# EAGLE schematic jd9_redraw (EAGLE 9.6.0)
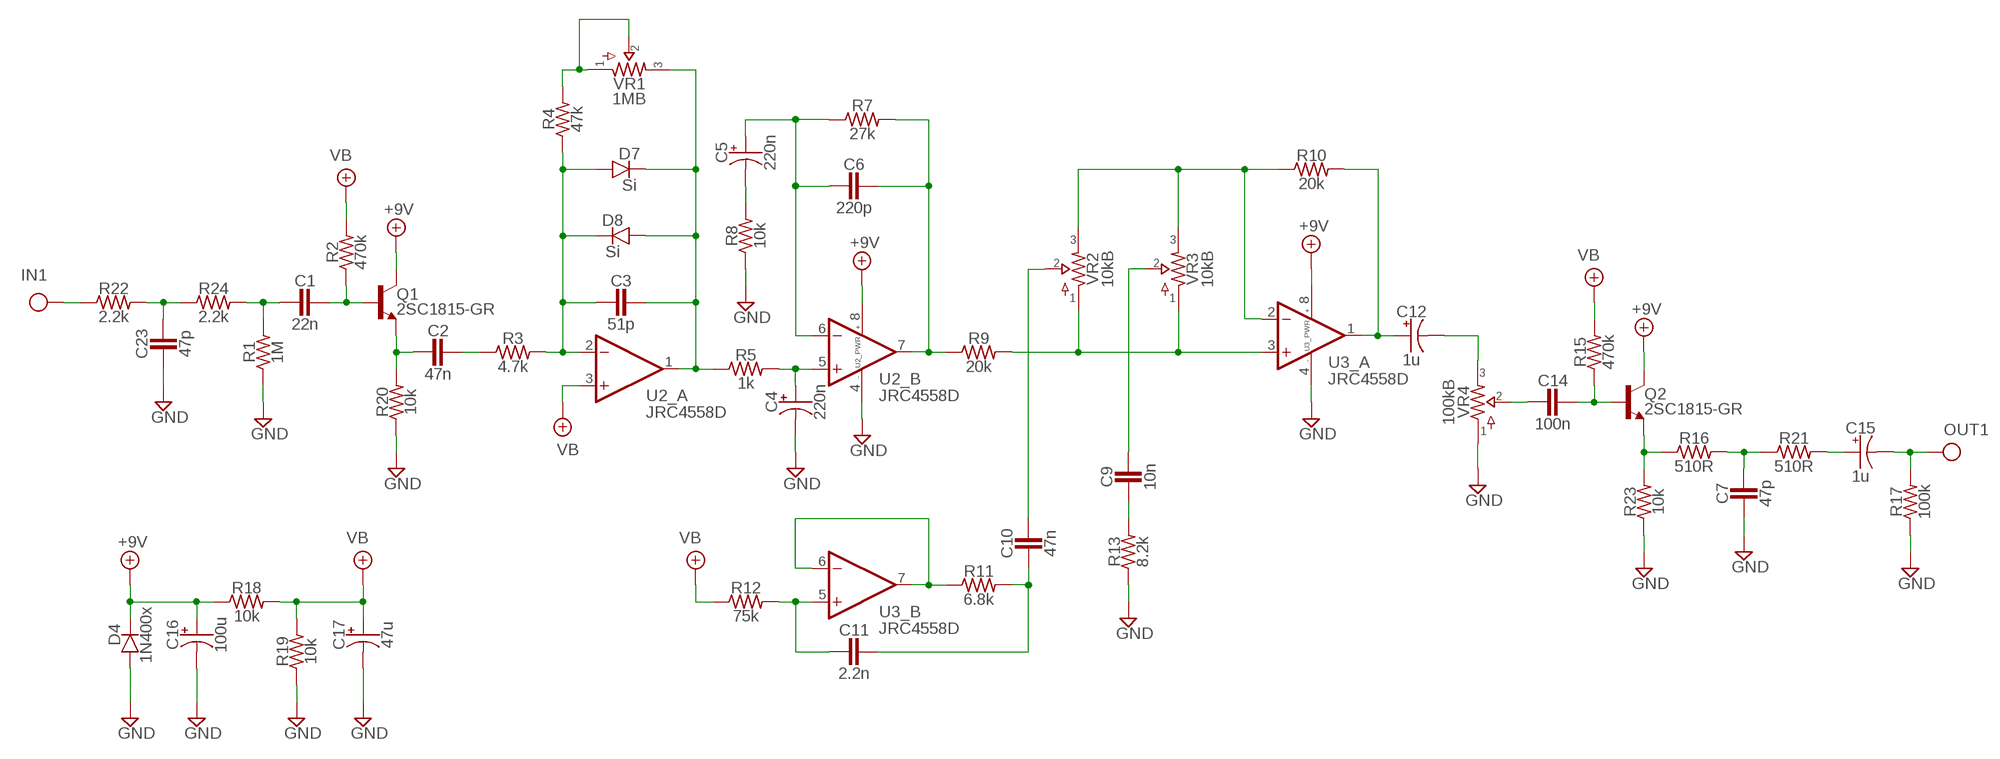
[diagram p0: schematic, sheet 1]

## Parts
C1  22n  CER/FILMBOX.1  [BOX_SMALL]
C2  47n  CER/FILMBOX.1  [BOX_SMALL]
C3  51p  CER/FILMBOX.1  [BOX_SMALL]
C4  220n  0500  [050_020]
C5  220n  0500  [050_020]
C6  220p  CER/FILMBOX.1  [BOX_SMALL]
C7  47p  CER/FILMBOX.1  [BOX_SMALL]
C9  10n  CER/FILMBOX.1  [BOX_SMALL]
C10  47n  CER/FILMBOX.1  [BOX_SMALL]
C11  2.2n  CER/FILMBOX.1  [BOX_SMALL]
C12  1u  0500  [050_020]
C14  100n  CER/FILMBOX.1  [BOX_SMALL]
C15  1u  0500  [050_020]
C16  100u  0500  [050_020]
C17  47u  0500  [050_020]
C23  47p  CER/FILMBOX.1  [BOX_SMALL]
D4  1N400x  DO41.2  [DO41-2]
D7  Si  DO35.2  [DO35-2]
D8  Si  DO35.2  [DO35-2]
Q1  2SC1815-GR  2N3904  [TO92-]
Q2  2SC1815-GR  2N3904  [TO92-]
R1  1M  R_.3B  [R0207/3]
R2  470k  R_.3B  [R0207/3]
R3  4.7k  R_.3B  [R0207/3]
R4  47k  R_.3B  [R0207/3]
R5  1k  R_.3B  [R0207/3]
R7  27k  R_.3B  [R0207/3]
R8  10k  R_.3B  [R0207/3]
R9  20k  R_.3B  [R0207/3]
R10  20k  R_.3B  [R0207/3]
R11  6.8k  R_.3B  [R0207/3]
R12  75k  R_.3B  [R0207/3]
R13  8.2k  R_.3B  [R0207/3]
R15  470k  R_.3B  [R0207/3]
R16  510R  R_.3B  [R0207/3]
R17  100k  R_.3B  [R0207/3]
R18  10k  R_.3B  [R0207/3]
R19  10k  R_.3B  [R0207/3]
R20  10k  R_.3B  [R0207/3]
R21  510R  R_.3B  [R0207/3]
R22  2.2k  R_.3B  [R0207/3]
R23  10k  R_.3B  [R0207/3]
R24  2.2k  R_.3B  [R0207/3]
U2  JRC4558D  DUALTH  [DIL0]
U3  JRC4558D  DUALTH  [DIL0]
VR1  1MB  POTS16MM  [16MM]
VR2  10kB  POTS16MM  [16MM]
VR3  10kB  POTS16MM  [16MM]
VR4  100kB  POTS16MM  [16MM]

## Nets
+9V: C16.+ D4.C Q1.1(C) Q2.1(C) R18.1 U2.8(_PWR:V+) U3.8(_PWR:V+)
GND: C4.- C7.2 C16.- C17.- C23.2 D4.A R1.1 R8.1 R13.1 R17.1 R19.1 R20.1 R23.1 U2.4(_PWR:V-) U3.4(_PWR:V-) VR4.1
IN: R22.1
N$2: C23.1 R22.2 R24.1
N$3: C1.2 R1.2 R24.2
N$4: C1.1 Q1.2(B) R2.1
N$5: C2.2 Q1.3(E) R20.2
N$6: C2.1 R3.1
N$7: C3.2 D7.A D8.C R3.2 R4.1 U2.2(_A:-IN)
N$8: R4.2 VR1.1 VR1.2
N$9: C3.1 D7.C D8.A R5.1 U2.1(_A:OUT) VR1.3
N$10: R9.2 U3.3(_A:+IN) VR2.1 VR3.1
N$11: C4.+ R5.2 U2.5(_B:+IN)
N$12: C5.+ C6.2 R7.1 U2.6(_B:-IN)
N$13: C6.1 R7.2 R9.1 U2.7(_B:OUT)
N$14: R10.1 U3.2(_A:-IN) VR2.3 VR3.3
N$15: C5.- R8.2
N$16: C12.+ R10.2 U3.1(_A:OUT)
N$17: C11.2 R12.2 U3.5(_B:+IN)
N$18: R11.1 U3.6(_B:-IN) U3.7(_B:OUT)
N$19: C10.2 C11.1 R11.2
N$20: C9.1 VR3.2
N$21: C10.1 VR2.2
N$22: C9.2 R13.2
N$23: C12.- VR4.3
N$24: C14.2 VR4.2
N$25: C14.1 Q2.2(B) R15.1
N$26: Q2.3(E) R16.1 R23.2
N$27: C7.1 R16.2 R21.1
N$28: C15.+ R21.2
OUT: C15.- R17.2
VB: C17.+ R2.2 R12.1 R15.2 R18.2 R19.2 U2.3(_A:+IN)

## Library data of the parts
C1-C3 C6 C7 C9-C11 C14 C23 = pedals-capacitors-film:CER/FILM: 47 - 120pF Xicon Ceramic Disc 2.5mm lead spacing
C4 C5 C12 C15-C17 = pedals-capacitors-elec:050
D4 = pedals-diodes:DO41: DO-41 Package Diodes: 1N4001 - 1N40019 Zener Diodes: 1N4728 - 1N4764
D7 D8 = pedals-diodes:DO35: DO-35 Package Diodes: 1N914
Q1 Q2 = pedals-transistors:2N3904: NPN Transistor
R1-R5 R7-R13 R15-R24 = pedals-resistors:R_
U2 U3 = pedals-integrated circuits:DUAL: OP AMP
VR1-VR4 = pedals-potentiometers:POTS